# Altium schematic sheet IDC_EXT_Connectors.SchDoc
size 420 x 297 mm; DocumentNumber: 4; SheetNumber: 4; SheetTotal: 6; EDA_Number: ARTIQ; ModifiedBy: -; Title2: -; DivGrp: ISE; ModifiedDate: -
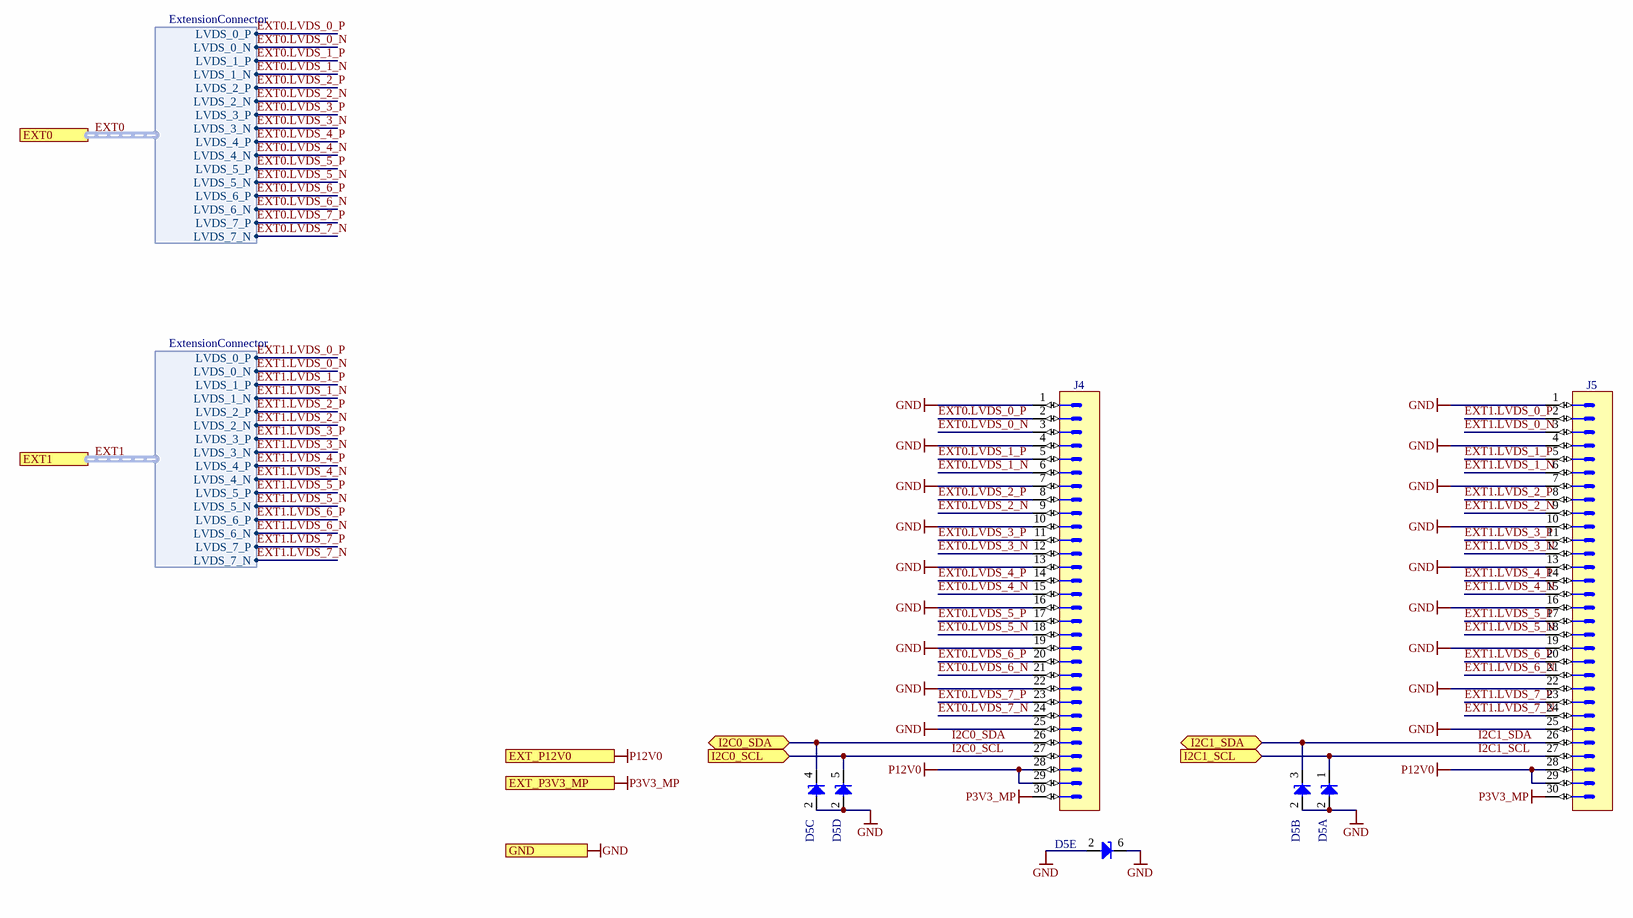
[diagram p0: IDC_EXT_Connectors.SchDoc]

## Parts
D5  PESD3V3L5UY  [SOT65P210X110-6N]  (value not drawn)  (parts A,B,C,D,E of 5)
J4  (no value)  [3M_N2530-6002RB]
J5  (no value)  [3M_N2530-6002RB]

## Ports
EXT0 (harness ExtensionConnector), EXT1 (harness ExtensionConnector), EXT_P3V3_MP (in), EXT_P12V0 (in), GND, I2C0_SCL (in), I2C0_SDA (bidir), I2C1_SCL (in), I2C1_SDA (bidir)

## Harnesses
ExtensionConnector: LVDS_0_N, LVDS_0_P, LVDS_1_N, LVDS_1_P, LVDS_2_N, LVDS_2_P, LVDS_3_N, LVDS_3_P, LVDS_4_N, LVDS_4_P, LVDS_5_N, LVDS_5_P, LVDS_6_N, LVDS_6_P, LVDS_7_N, LVDS_7_P

## Nets
GND: D5.2(A) D5.6(C) J4.1 J4.4 J4.7 J4.10 J4.13 J4.16 J4.19 J4.22 J4.25 J5.1 J5.4 J5.7 J5.10 J5.13 J5.16 J5.19 J5.22 J5.25 ; port GND
P3V3_MP: J4.30 J5.30 ; port EXT_P3V3_MP
P12V0: J4.28 J4.29 J5.28 J5.29 ; port EXT_P12V0
EXT0.LVDS_0_N: J4.3 ; port EXT0.LVDS_0_N
EXT0.LVDS_0_P: J4.2 ; port EXT0.LVDS_0_P
EXT0.LVDS_1_N: J4.6 ; port EXT0.LVDS_1_N
EXT0.LVDS_1_P: J4.5 ; port EXT0.LVDS_1_P
EXT0.LVDS_2_N: J4.9 ; port EXT0.LVDS_2_N
EXT0.LVDS_2_P: J4.8 ; port EXT0.LVDS_2_P
EXT0.LVDS_3_N: J4.12 ; port EXT0.LVDS_3_N
EXT0.LVDS_3_P: J4.11 ; port EXT0.LVDS_3_P
EXT0.LVDS_4_N: J4.15 ; port EXT0.LVDS_4_N
EXT0.LVDS_4_P: J4.14 ; port EXT0.LVDS_4_P
EXT0.LVDS_5_N: J4.18 ; port EXT0.LVDS_5_N
EXT0.LVDS_5_P: J4.17 ; port EXT0.LVDS_5_P
EXT0.LVDS_6_N: J4.21 ; port EXT0.LVDS_6_N
EXT0.LVDS_6_P: J4.20 ; port EXT0.LVDS_6_P
EXT0.LVDS_7_N: J4.24 ; port EXT0.LVDS_7_N
EXT0.LVDS_7_P: J4.23 ; port EXT0.LVDS_7_P
EXT1.LVDS_0_N: J5.3 ; port EXT1.LVDS_0_N
EXT1.LVDS_0_P: J5.2 ; port EXT1.LVDS_0_P
EXT1.LVDS_1_N: J5.6 ; port EXT1.LVDS_1_N
EXT1.LVDS_1_P: J5.5 ; port EXT1.LVDS_1_P
EXT1.LVDS_2_N: J5.9 ; port EXT1.LVDS_2_N
EXT1.LVDS_2_P: J5.8 ; port EXT1.LVDS_2_P
EXT1.LVDS_3_N: J5.12 ; port EXT1.LVDS_3_N
EXT1.LVDS_3_P: J5.11 ; port EXT1.LVDS_3_P
EXT1.LVDS_4_N: J5.15 ; port EXT1.LVDS_4_N
EXT1.LVDS_4_P: J5.14 ; port EXT1.LVDS_4_P
EXT1.LVDS_5_N: J5.18 ; port EXT1.LVDS_5_N
EXT1.LVDS_5_P: J5.17 ; port EXT1.LVDS_5_P
EXT1.LVDS_6_N: J5.21 ; port EXT1.LVDS_6_N
EXT1.LVDS_6_P: J5.20 ; port EXT1.LVDS_6_P
EXT1.LVDS_7_N: J5.24 ; port EXT1.LVDS_7_N
EXT1.LVDS_7_P: J5.23 ; port EXT1.LVDS_7_P
I2C0_SCL: D5.5(C) J4.27 ; port I2C0_SCL
I2C0_SDA: D5.4(C) J4.26 ; port I2C0_SDA
I2C1_SCL: D5.1(C) J5.27 ; port I2C1_SCL
I2C1_SDA: D5.3(C) J5.26 ; port I2C1_SDA

## Buses and harness runs
harness EXT0 = port EXT0
harness EXT1 = port EXT1

## Notes on the sheet
- Project/Equipment
- Document
- Designer
- Drawn by
- Check.by
- Copyright WUT 2023.
  This document describes Open Hardware and is licensed under the CERN-OHL-W v2
  You may redistribute and modify this documentation and make products using it under the terms of the CERN-OHL-W v2 (https:/cern.ch/cern-ohl). This documentation is distributed WITHOUT ANY EXPRESS OR IMPLIED WARRANTY, INCLUDING OF MERCHANTABILITY, SATISFACTORY QUALITY AND FITNESS FOR A PARTICULAR PURPOSE. Please see the CERN-OHL-W v2 for applicable conditions.
  Source location: https://github.com/sinara-hw/EEM_FMC_Carrier
  As per CERN-OHL-W v2 section 4, should You produce hardware based on these sources, You must maintain the Source Location visible on the silkscreen or top copper for a EEM FMC Carrier PCB or other product you make using this documentation.
- Contact:
- File
- Last Mod.
- Print Date
- Sheet
- Size
- A3
- of
- Rev

## Library data of the parts
D5 = PESD3V3L5UY: Fivefold ESD Protection Diode Arrays; Part Description: Fivefold ESD Protection Diode Arrays (30kV); Manufacturer: NEXPERIA; Voltage: 3.3V; Power: 200W; PressFit: No; Bonding: No; Part Number: PESD3V3L5UY; Component Kind: Standard; Component Type: Standard; Device: PESD3V3L5UY; PackageDescription: SOT363, SC-88, 0.65mm Pitch; 6 Pin, 1.25mm W X 2.00mm L X 1.10mm H body, IPC Medium Density; Manufacturer Part Number: PESD3V3L5UY; Pin Count: 6; Case: SOT363; Mounted: Yes; Socket: No; SMD: Yes; Sense: No; ComponentHeight: 1.1mm; HelpURL: \\cern.ch\dfs\Applications\Altium\Datasheets\PESD3V3L5UY.pdf; Author: CERN DEM WB; CreateDate: 05.07.2021; LatestRevisionDate: 05.07.2021
J4 J5 = 3M_N2530-6002RB: Connector 30 Male; Part Description: 30 Contacts - Straight .100'' x .100'' Low Profile Four-Wall Header, 2500 Series; Manufacturer: 3M; PressFit: No; Part Number: 3M_N2530-6002RB; Component Kind: Standard; Component Type: Standard; Pin Count: 30; Family: Header 30; Mounted: Yes; Socket: No; SMD: No; Sense: No; Status: None; Manufacturer Part Number: N2530-6002RB; ComponentHeight: 10.03mm; HelpURL: \\cern.ch\dfs\Applications\Altium\Datasheets\3M_N2530-6002RB.pdf; Author: CERN DEM JLC; CreateDate: 11.02.2009; LatestRevisionDate: 11.08.2009